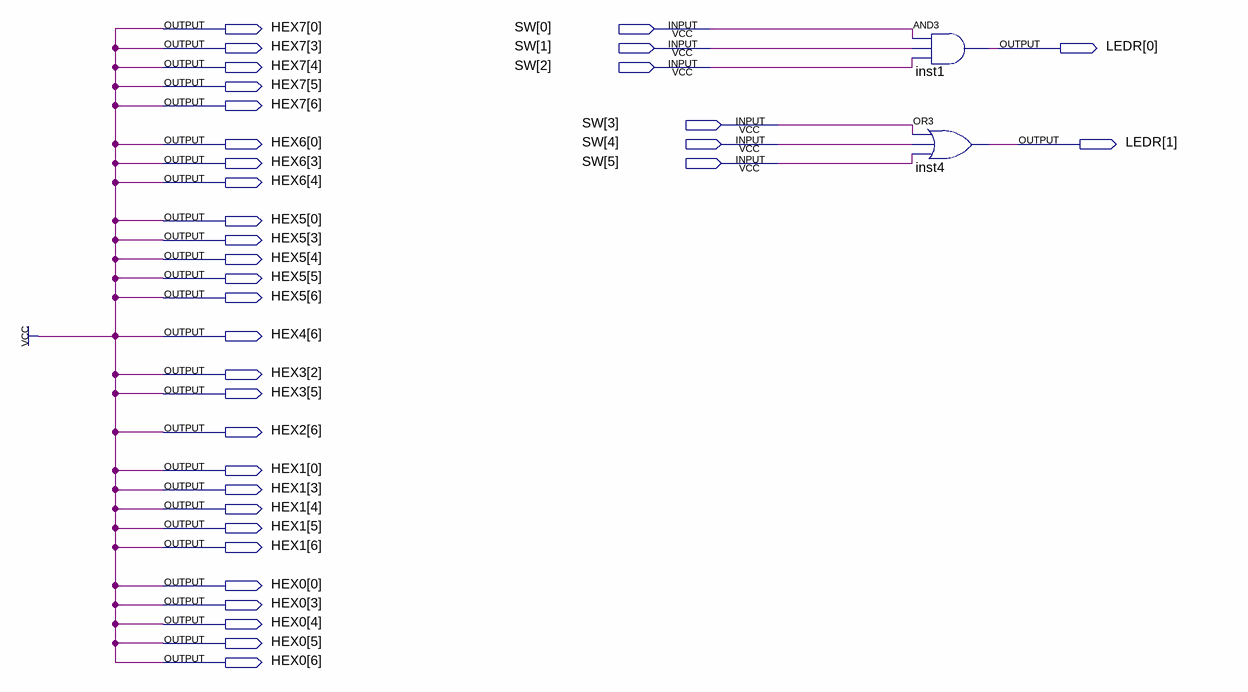
[diagram p0: schematic sheet]
// Quartus schematic datum+logika.bdf as structural Verilog: 2 symbols, 35 pins
module \datum+logika  (
  input  [5:0] SW,
  output [6:0] HEX7,
  output [1:0] LEDR,
  output [4:0] HEX6,
  output [6:0] HEX5,
  output [6:6] HEX4,
  output [5:2] HEX3,
  output [6:6] HEX2,
  output [6:0] HEX1,
  output [6:0] HEX0
);

  and inst1 (LEDR[0], SW[0], SW[1], SW[2]);
  or inst4 (LEDR[1], SW[3], SW[4], SW[5]);

  assign {HEX0[6:3], HEX0[0]} = {5{1'b1}};
  assign {HEX1[6:3], HEX1[0]} = {5{1'b1}};
  assign HEX2[6] = 1'b1;
  assign {HEX3[5], HEX3[2]} = 2'b11;
  assign HEX4[6] = 1'b1;
  assign {HEX5[6:3], HEX5[0]} = {5{1'b1}};
  assign {HEX6[4:3], HEX6[0]} = 3'b111;
  assign {HEX7[6:3], HEX7[0]} = {5{1'b1}};
endmodule
